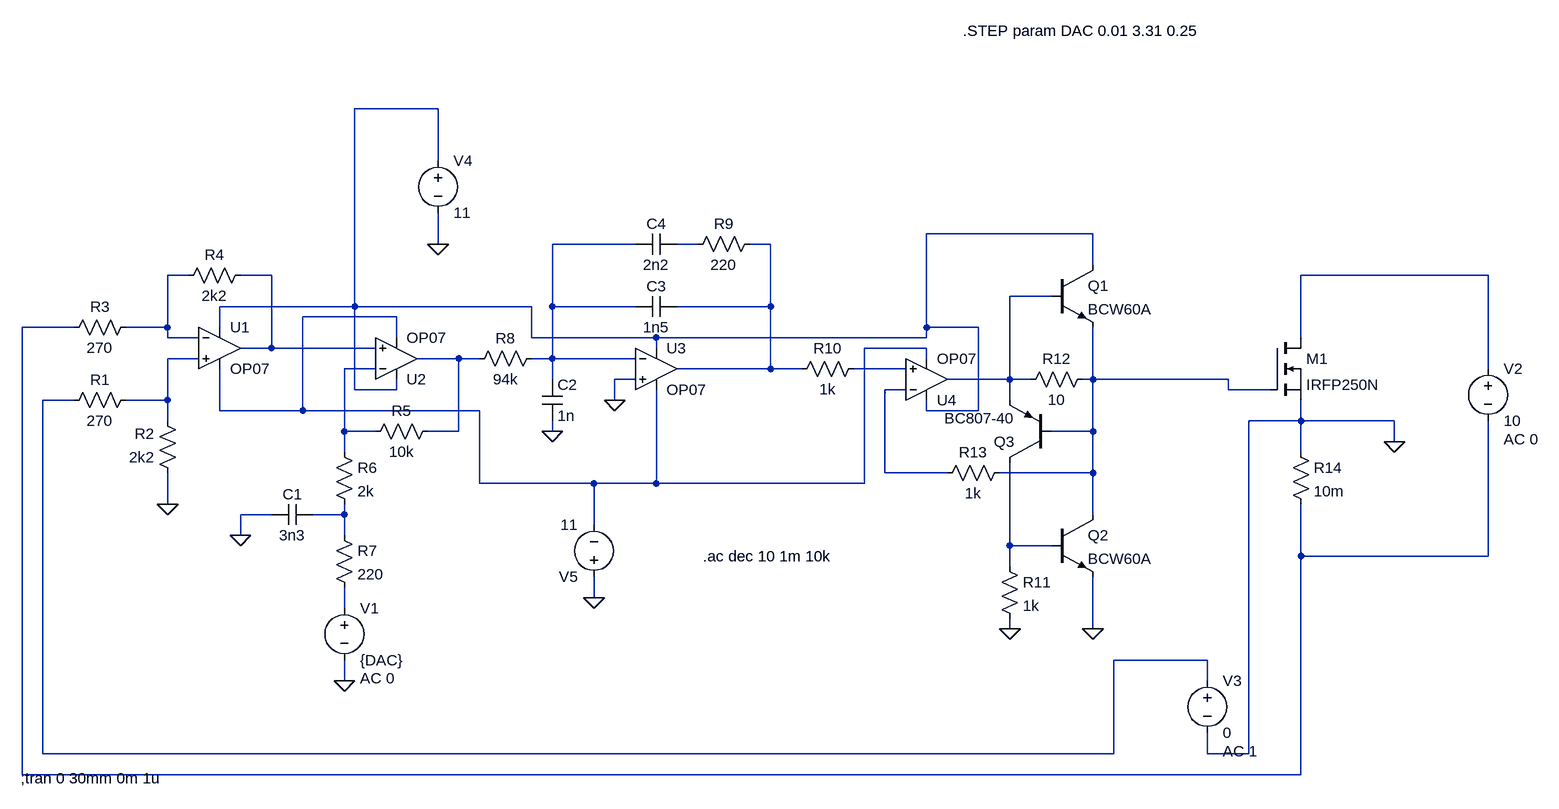
[diagram p0: schematic bap.asc]
bap.asc, the LTspice schematic file:
Version 4
SHEET 1 2080 920
WIRE 384 -128 256 -128
WIRE 384 -48 384 -128
WIRE 1392 64 1136 64
WIRE 384 80 384 32
WIRE 688 80 560 80
WIRE 784 80 752 80
WIRE 896 80 864 80
WIRE 1392 112 1392 64
WIRE 0 128 -32 128
WIRE 128 128 80 128
WIRE 2000 128 1712 128
WIRE 1328 160 1264 160
WIRE 256 176 256 -128
WIRE 256 176 48 176
WIRE 528 176 256 176
WIRE 560 176 560 80
WIRE 688 176 560 176
WIRE 896 176 896 80
WIRE 896 176 752 176
WIRE 320 192 176 192
WIRE -176 208 -256 208
WIRE -32 208 -32 128
WIRE -32 208 -96 208
WIRE 48 208 48 176
WIRE 1136 208 1136 64
WIRE 1216 208 1136 208
WIRE -32 224 -32 208
WIRE 16 224 -32 224
WIRE 320 224 320 192
WIRE 528 224 528 176
WIRE 720 224 528 224
WIRE 1136 224 1136 208
WIRE 1136 224 720 224
WIRE 1712 224 1712 128
WIRE 128 240 128 128
WIRE 128 240 80 240
WIRE 288 240 128 240
WIRE 720 240 720 224
WIRE 1136 240 1040 240
WIRE 16 256 -32 256
WIRE 416 256 352 256
WIRE 448 256 416 256
WIRE 560 256 560 176
WIRE 560 256 528 256
WIRE 688 256 560 256
WIRE 1136 256 1136 240
WIRE 288 272 240 272
WIRE 896 272 896 176
WIRE 896 272 752 272
WIRE 944 272 896 272
WIRE 1104 272 1024 272
WIRE 2000 272 2000 128
WIRE 560 288 560 256
WIRE 688 288 656 288
WIRE 1264 288 1264 160
WIRE 1264 288 1168 288
WIRE 1296 288 1264 288
WIRE 1392 288 1392 208
WIRE 1392 288 1376 288
WIRE 1600 288 1392 288
WIRE 256 304 256 176
WIRE 320 304 320 288
WIRE 320 304 256 304
WIRE 1104 304 1072 304
WIRE 1600 304 1600 288
WIRE 1664 304 1600 304
WIRE -176 320 -224 320
WIRE -32 320 -32 256
WIRE -32 320 -96 320
WIRE 656 320 656 288
WIRE 1264 320 1264 288
WIRE 48 336 48 272
WIRE 176 336 176 192
WIRE 176 336 48 336
WIRE 448 336 176 336
WIRE 1136 336 1136 320
WIRE 1216 336 1216 208
WIRE 1216 336 1136 336
WIRE -32 352 -32 320
WIRE 1712 352 1712 320
WIRE 1712 352 1632 352
WIRE 1856 352 1712 352
WIRE 240 368 240 272
WIRE 288 368 240 368
WIRE 416 368 416 256
WIRE 416 368 368 368
WIRE 560 368 560 352
WIRE 1392 368 1392 288
WIRE 1392 368 1328 368
WIRE 1856 384 1856 352
WIRE 240 400 240 368
WIRE 1712 400 1712 352
WIRE 1072 432 1072 304
WIRE 1168 432 1072 432
WIRE 1392 432 1392 368
WIRE 1392 432 1248 432
WIRE 448 448 448 336
WIRE 624 448 448 448
WIRE 720 448 720 304
WIRE 720 448 624 448
WIRE 1040 448 1040 240
WIRE 1040 448 720 448
WIRE -32 480 -32 432
WIRE 128 496 80 496
WIRE 240 496 240 480
WIRE 240 496 192 496
WIRE 1392 496 1392 432
WIRE 624 512 624 448
WIRE 80 528 80 496
WIRE 240 528 240 496
WIRE 1264 544 1264 416
WIRE 1328 544 1264 544
WIRE 1712 560 1712 480
WIRE 2000 560 2000 352
WIRE 2000 560 1712 560
WIRE 1264 576 1264 544
WIRE 624 624 624 592
WIRE 240 640 240 608
WIRE 1264 672 1264 656
WIRE 1392 672 1392 592
WIRE 1568 720 1424 720
WIRE 240 752 240 720
WIRE 1568 752 1568 720
WIRE -224 864 -224 320
WIRE 1424 864 1424 720
WIRE 1424 864 -224 864
WIRE 1568 864 1568 832
WIRE 1632 864 1632 352
WIRE 1632 864 1568 864
WIRE -256 896 -256 208
WIRE 1712 896 1712 560
WIRE 1712 896 -256 896
FLAG -32 480 0
FLAG 80 528 0
FLAG 240 752 0
FLAG 560 368 0
FLAG 656 320 0
FLAG 1264 672 0
FLAG 1392 672 0
FLAG 384 80 0
FLAG 624 624 0
FLAG 1856 384 0
SYMBOL Opamps\\OP07 48 176 R0
SYMATTR InstName U1
SYMBOL Opamps\\OP07 320 320 M180
SYMATTR InstName U2
SYMBOL Opamps\\OP07 720 208 R0
SYMATTR InstName U3
SYMBOL Opamps\\OP07 1136 352 M180
SYMATTR InstName U4
SYMBOL res -80 304 R90
WINDOW 0 0 56 VBottom 2
WINDOW 3 32 56 VTop 2
SYMATTR InstName R1
SYMATTR Value 270
SYMBOL res -16 448 R180
WINDOW 0 36 76 Left 2
WINDOW 3 36 40 Left 2
SYMATTR InstName R2
SYMATTR Value 2k2
SYMBOL res -80 192 R90
WINDOW 0 0 56 VBottom 2
WINDOW 3 32 56 VTop 2
SYMATTR InstName R3
SYMATTR Value 270
SYMBOL res 96 112 R90
WINDOW 0 0 56 VBottom 2
WINDOW 3 32 56 VTop 2
SYMATTR InstName R4
SYMATTR Value 2k2
SYMBOL res 384 352 R90
WINDOW 0 0 56 VBottom 2
WINDOW 3 32 56 VTop 2
SYMATTR InstName R5
SYMATTR Value 10k
SYMBOL res 224 384 R0
SYMATTR InstName R6
SYMATTR Value 2k
SYMBOL res 224 512 R0
SYMATTR InstName R7
SYMATTR Value 220
SYMBOL cap 192 480 R90
WINDOW 0 0 32 VBottom 2
WINDOW 3 32 32 VTop 2
SYMATTR InstName C1
SYMATTR Value 3n3
SYMBOL voltage 240 624 R0
WINDOW 123 24 124 Left 2
WINDOW 39 0 0 Left 2
SYMATTR InstName V1
SYMATTR Value {DAC}
SYMATTR Value2 AC 0
SYMBOL res 544 240 R90
WINDOW 0 0 56 VBottom 2
WINDOW 3 32 56 VTop 2
SYMATTR InstName R8
SYMATTR Value 94k
SYMBOL cap 544 288 R0
SYMATTR InstName C2
SYMATTR Value 1n
SYMBOL cap 752 160 R90
WINDOW 0 0 32 VBottom 2
WINDOW 3 32 32 VTop 2
SYMATTR InstName C3
SYMATTR Value 1n5
SYMBOL cap 752 64 R90
WINDOW 0 0 32 VBottom 2
WINDOW 3 32 32 VTop 2
SYMATTR InstName C4
SYMATTR Value 2n2
SYMBOL res 880 64 R90
WINDOW 0 0 56 VBottom 2
WINDOW 3 32 56 VTop 2
SYMATTR InstName R9
SYMATTR Value 220
SYMBOL res 1040 256 R90
WINDOW 0 0 56 VBottom 2
WINDOW 3 32 56 VTop 2
SYMATTR InstName R10
SYMATTR Value 1k
SYMBOL npn3 1328 112 R0
SYMATTR InstName Q1
SYMATTR Value BCW60A
SYMBOL npn3 1328 496 R0
SYMATTR InstName Q2
SYMATTR Value BCW60A
SYMBOL pnp2 1328 416 R180
SYMATTR InstName Q3
SYMATTR Value BC807-40
SYMBOL res 1248 560 R0
SYMATTR InstName R11
SYMATTR Value 1k
SYMBOL res 1392 272 R90
WINDOW 0 0 56 VBottom 2
WINDOW 3 32 56 VTop 2
SYMATTR InstName R12
SYMATTR Value 10
SYMBOL res 1264 416 R90
WINDOW 0 0 56 VBottom 2
WINDOW 3 32 56 VTop 2
SYMATTR InstName R13
SYMATTR Value 1k
SYMBOL nmos 1664 224 R0
SYMATTR InstName M1
SYMATTR Value IRFP250N
SYMBOL res 1696 384 R0
SYMATTR InstName R14
SYMATTR Value 10m
SYMBOL voltage 2000 256 R0
WINDOW 123 24 124 Left 2
WINDOW 39 0 0 Left 2
SYMATTR InstName V2
SYMATTR Value 10
SYMATTR Value2 AC 0
SYMBOL voltage 1568 736 R0
WINDOW 123 24 124 Left 2
WINDOW 39 0 0 Left 2
SYMATTR InstName V3
SYMATTR Value 0
SYMATTR Value2 AC 1
SYMBOL voltage 384 -64 R0
WINDOW 123 0 0 Left 2
WINDOW 39 0 0 Left 2
SYMATTR InstName V4
SYMATTR Value 11
SYMBOL voltage 624 608 R180
WINDOW 123 0 0 Left 2
WINDOW 39 0 0 Left 2
SYMATTR InstName V5
SYMATTR Value 11
TEXT 792 560 Left 2 !.ac dec 10 1m 10k
TEXT -258 902 Left 2 !;tran 0 30mm 0m 1u
TEXT 1192 -248 Left 2 !.STEP param DAC 0.01 3.31 0.25

The netlist it stands for:
* bap.asc
XU1 N011 N005 N001 N009 N006 LT1001  ; OP07, pins In+ In- V+ V- OUT
XU2 N006 N013 N001 N009 N012 LT1001  ; OP07, pins In+ In- V+ V- OUT
XU3 0 N002 N001 N009 N004 LT1001  ; OP07, pins In+ In- V+ V- OUT
XU4 N014 N016 N001 N009 N008 LT1001  ; OP07, pins In+ In- V+ V- OUT
R1 N011 N017 270
R2 0 N011 2k2
R3 N005 N010 270
R4 N006 N005 2k2
R5 N012 N013 10k
R6 N013 N018 2k
R7 N018 N020 220
C1 N018 0 3n3
V1 N020 0 {DAC} AC 0
R8 N002 N012 94k
C2 N002 0 1n
C3 N004 N002 1n5
C4 N003 N002 2n2
R9 N004 N003 220
R10 N014 N004 1k
Q1 N001 N008 N015 0 BCW60A
Q2 N015 N019 0 0 BCW60A
Q3 N019 N015 N008 0 BC807-40
R11 N019 0 1k
R12 N015 N008 10
R13 N015 N016 1k
M1 N007 N015 0 0 IRFP250N
R14 0 N010 10m
V2 N007 N010 10 AC 0
V3 N017 0 0 AC 1
V4 N001 0 11
V5 0 N009 11
.model NPN NPN
.model PNP PNP
.lib standard.bjt
.model NMOS NMOS
.model PMOS PMOS
.lib standard.mos
.ac dec 10 1m 10k
;tran 0 30mm 0m 1u
.STEP param DAC 0.01 3.31 0.25
.lib LTC.lib
.backanno
.end